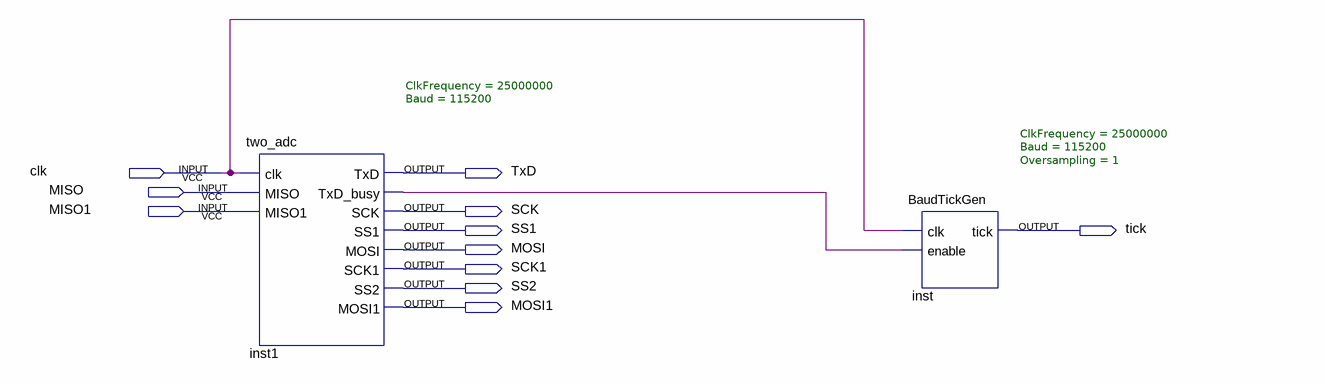
[diagram p0: schematic sheet]
// Quartus schematic Block1.bdf as structural Verilog: 2 symbols, 11 pins
module Block1 (
  input  clk,
  input  MISO,
  input  MISO1,
  output TxD,
  output SCK,
  output SS1,
  output tick,
  output MOSI,
  output SCK1,
  output SS2,
  output MOSI1
);

  wire inst1_txd_busy;

  two_adc #(.ClkFrequency(25000000), .Baud(115200)) inst1 (
    .clk(clk), .MISO(MISO), .MISO1(MISO1), .TxD(TxD), .TxD_busy(inst1_txd_busy), .SCK(SCK), .SS1(SS1),
    .MOSI(MOSI), .SCK1(SCK1), .SS2(SS2), .MOSI1(MOSI1));
  BaudTickGen #(.ClkFrequency(25000000), .Baud(115200), .Oversampling(1)) inst (
    .clk(clk), .enable(inst1_txd_busy), .tick(tick));
endmodule
